# EAGLE design t_eau (EAGLE 8.4.3)
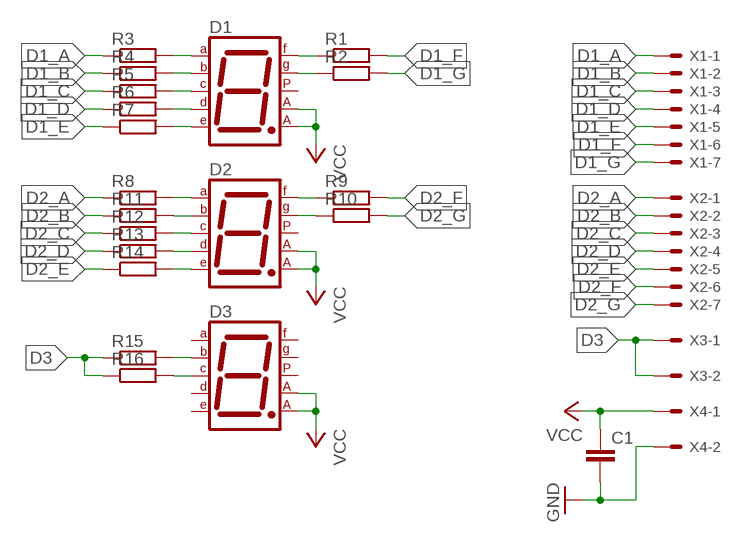
[diagram p0: schematic, sheet 1]

## Parts
C1  C-EU025-025X050  [C025-025X050]
D1  7SEG-CA  [7SEG-13]
D2  7SEG-CA  [7SEG-13]
D3  7SEG-CA  [7SEG-13]
R1  R-EU_0204/7  [0204/7]
R2  R-EU_0204/7  [0204/7]
R3  R-EU_0204/7  [0204/7]
R4  R-EU_0204/7  [0204/7]
R5  R-EU_0204/7  [0204/7]
R6  R-EU_0204/7  [0204/7]
R7  R-EU_0204/7  [0204/7]
R8  R-EU_0204/7  [0204/7]
R9  R-EU_0204/7  [0204/7]
R10  R-EU_0204/7  [0204/7]
R11  R-EU_0204/7  [0204/7]
R12  R-EU_0204/7  [0204/7]
R13  R-EU_0204/7  [0204/7]
R14  R-EU_0204/7  [0204/7]
R15  R-EU_0204/7  [0204/7]
R16  R-EU_0204/7  [0204/7]
X1  KK-156-7  [KK-156-7]
X2  KK-156-7  [KK-156-7]
X3  KK-156-2  [KK-156-2]
X4  KK-156-2  [KK-156-2]

## Nets
D1_A: R3.1 X1.1
D1_B: R4.1 X1.2
D1_C: R5.1 X1.3
D1_D: R6.1 X1.4
D1_E: R7.1 X1.5
D1_F: R1.2 X1.6
D1_G: R2.2 X1.7
D2_A: R8.1 X2.1
D2_B: R11.1 X2.2
D2_C: R12.1 X2.3
D2_D: R13.1 X2.4
D2_E: R14.1 X2.5
D2_F: R9.2 X2.6
D2_G: R10.2 X2.7
D3: R15.1 R16.1 X3.1 X3.2
GND: C1.2 X4.2
N$1: D1.7(A) R3.2
N$2: D1.6(B) R4.2
N$3: D1.4(C) R5.2
N$4: D1.2(D) R6.2
N$5: D1.1(E) R7.2
N$6: D1.9(F) R1.1
N$7: D1.10(G) R2.1
N$8: D2.7(A) R8.2
N$9: D2.6(B) R11.2
N$10: D2.4(C) R12.2
N$11: D2.2(D) R13.2
N$12: D2.1(E) R14.2
N$13: D2.9(F) R9.1
N$14: D2.10(G) R10.1
N$32: D3.4(C) R16.2
N$33: D3.6(B) R15.2
VCC: C1.1 D1.3(CA1) D1.8(CA2) D2.3(CA1) D2.8(CA2) D3.3(CA1) D3.8(CA2) X4.1
Unconnected: D1.5(DP) D2.5(DP) D3.1(E) D3.2(D) D3.5(DP) D3.7(A) D3.9(F) D3.10(G)

## Library data of the parts
C1 = rcl:C-EU: CAPACITOR, European symbol
D1-D3 = special:7SEG-CA: 7-segment DISPLAY single anode, 13 mm
R1-R16 = resistor:R-EU_: RESISTOR, European symbol
X1 X2 = con-molex:KK-156-7: KK 156 HEADER Source: http://www.molex.com/pdm_docs/sd/026604100_sd.pdf; OC_FARNELL: unknown; OC_NEWARK: unknown
X3 X4 = con-molex:KK-156-2: KK 156 HEADER Source: http://www.molex.com/pdm_docs/sd/026604100_sd.pdf; OC_FARNELL: unknown; OC_NEWARK: unknown

## Board
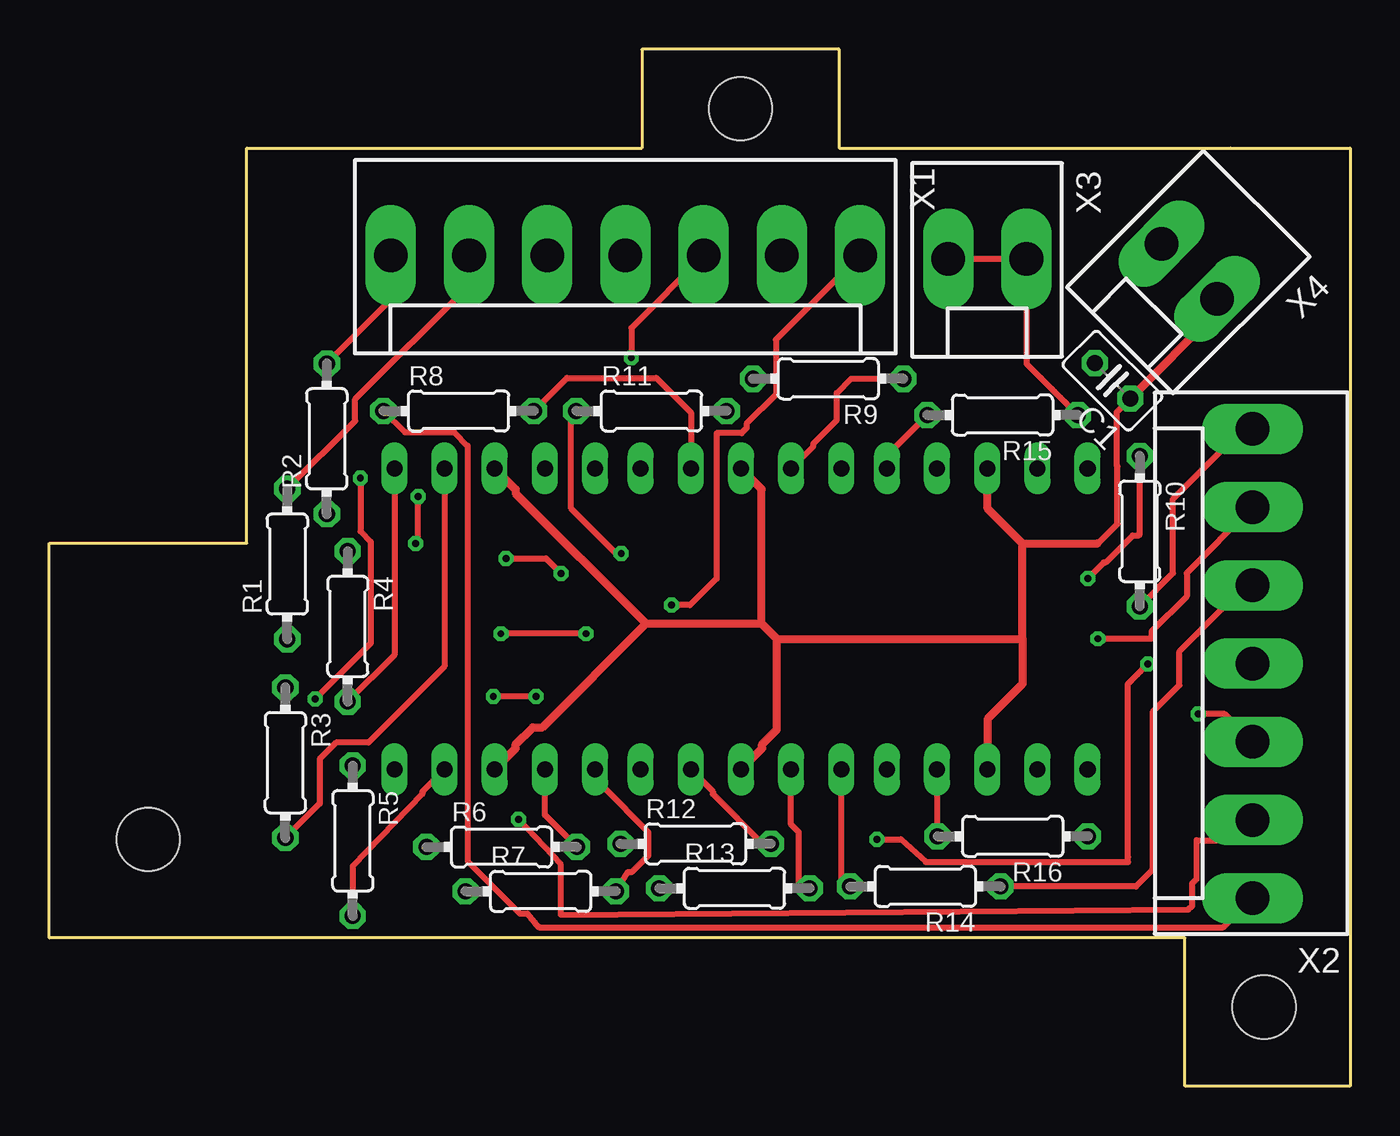
[diagram p1: board, top side]
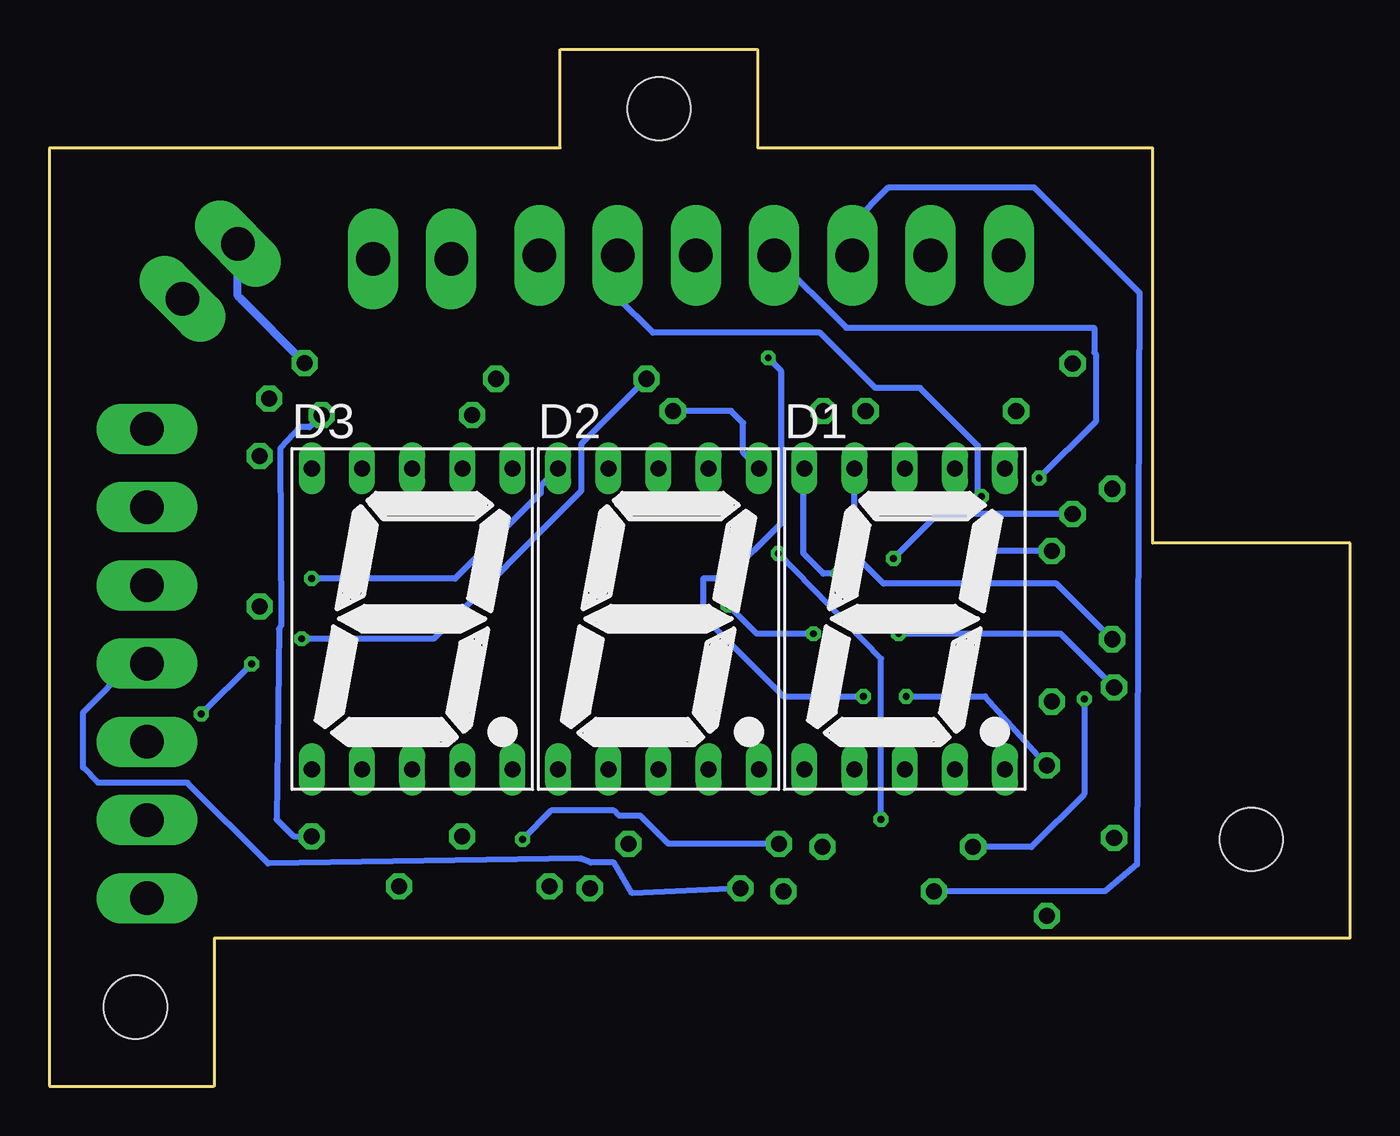
[diagram p2: board, bottom side, seen from below]

Size 65.86 x 52.5 mm. Coordinates in mm from the lower left corner, seen from the top.
Outline: 59.8,47.5 40,47.5 40,52.5 30,52.5 30,47.5 10,47.5 10,27.5 0,27.5 0,7.5 57.5,7.5 57.5,0
Outline: 59.82,47.5 65.86,47.5 65.86,0 57.53,0
Copper layers (1*16): Top 0.035mm / dielectric 1.5mm / Bottom 0.035mm
Design rules "default *": minimum track width 6mil, minimum drill 0.35mm, track to track 14mil, track to pad 14mil, pad to pad 14mil, via to via 14mil, smd to smd 6mil, copper to edge 40mil, drill to drill 6mil, minimum pad ring 10mil, minimum via ring 8mil, stop-mask expansion 4mil, vias tented up to drill 0mil, thermal gap 10mil
Holes 3.2 mm at 61.5,4 5,12.5 35,49.5

### Footprints (pad centres in the part's own frame; a part is rotated, then mirrored left to right if it is on the bottom)
C025-025X050 = drill 0.813 octagon: 1 -1.27,0; 2 1.27,0
7SEG-13 = drill 0.813 long: 1 -5.08,-7.62; 2 -2.54,-7.62; 3 0,-7.62; 4 2.54,-7.62; 5 5.08,-7.62; 6 5.08,7.62; 7 2.54,7.62; 8 0,7.62; 9 -2.54,7.62; 10 -5.08,7.62
0204/7 = drill 0.813 octagon: 1 -3.81,0; 2 3.81,0
KK-156-7 = drill 1.7 pad 2.184 long: 1 -11.88,0; 2 -7.92,0; 3 -3.96,0; 4 0,0; 5 3.96,0; 6 7.92,0; 7 11.88,0
KK-156-2 = drill 1.7 pad 2.184 long: 1 -1.98,0; 2 1.98,0

### Placement (x,y rotation side)
C1  53.83,35.72 135 top
D1  22.55,23.66 0 bottom
D2  35.02,23.66 0 bottom
D3  47.49,23.66 0 bottom
R1  12.05,26.44 90 top
R2  14.05,32.78 90 top
R3  11.95,16.38 270 top
R4  15.11,23.28 270 top
R5  15.36,12.42 270 top
R6  22.9,12.11 0 top
R7  24.88,9.86 0 top
R8  20.72,34.19 0 top
R9  39.43,35.82 180 top
R10  55.21,28.1 270 top
R11  30.49,34.19 0 top
R12  32.72,12.27 0 top
R13  34.69,10.02 0 top
R14  44.35,10.11 180 top
R15  48.26,33.98 180 top
R16  48.78,12.65 180 top
X1  29.17,42.06 180 top
X2  60.92,21.4 90 top
X3  47.49,41.9 180 top
X4  57.72,41.26 135 top

### Tracks (layer width: path | path; a pad name or v marks a point on that pad's centre or on a via)
D1_A  (via drill 0.35)
  Top 0.305: X1.1 36.79,37.8 36.79,35.03 35.31,33.55 35.31,33.32 35.05,33.07 33.78,33.07 33.78,25.7 32.43,24.36 v31.5,24.36 | v27.18,22.91 v22.86,22.91
  Bottom 0.305: v31.5,24.36 30.05,22.91 v27.18,22.91 | v22.86,22.91 14.67,22.91 R3.1
D1_B  (via drill 0.35)
  Top 0.305: v18.54,27.48 18.68,27.62 v18.68,29.86
  Bottom 0.305: R4.1 18.15,27.09 v18.54,27.48 | v18.68,29.86 18.84,30.02 18.84,32.42 21.78,35.36 24.05,35.36 26.84,38.15 35.31,38.15 37.09,39.93 X1.2
D1_C  (via drill 0.35)
  Top 0.305: X1.3 29.46,38.39 v29.46,36.88 | v24.64,19.74 v22.48,19.74
  Bottom 0.305: v29.46,36.88 28.83,36.25 28.83,28.5 31.62,25.7 32.77,25.7 32.77,23.8 28.7,19.74 v24.64,19.74 | v22.48,19.74 18.48,19.74 R5.1
D1_D  (via drill 0.35)
  Top 0.305: v15.75,30.78 15.75,28.1 16.28,27.57 16.28,22.42 v13.46,19.61
  Bottom 0.305: X1.4 25.51,38.4 12.95,38.4 12.95,37.15 12.88,37.07 12.88,33.65 v15.75,30.78 | v13.46,19.61 13.46,14.78 16.13,12.11 R6.1
D1_E
  Bottom 0.305: X1.5 25.21,43.67 23.37,45.52 16,45.52 10.67,40.18 10.79,11.23 12.41,9.86 R7.1
D1_F
  Top 0.305: R1.2 15.49,33.69 15.49,34.78 21.25,40.54 X1.6
D1_G
  Top 0.305: R2.2 17.29,39.83 X1.7
D2_A
  Top 0.305: R8.1 17.99,33.11 20.49,33.11 21.18,32.42 21.18,11.38 23.82,8.75 24.2,8.75 24.77,8.05 59.45,8.05 X2.1
D2_B  (via drill 0.35)
  Top 0.305: v23.75,13.51 25.91,11.23 25.91,8.69 57.68,8.94 57.86,9.13 57.86,10.26 58.09,10.49 58.09,12.45 59.89,12.45 X2.2 | v28.96,26.97 28.7,26.97 26.42,29.26 26.42,33.93 R11.1
  Bottom 0.305: v23.75,13.51 23.75,21.64 v28.96,26.97
D2_C  (via drill 0.35)
  Top 0.305: v41.91,12.5 43.11,12.5 44.38,11.36 54.61,11.36 54.61,11.61 54.61,20.37 v55.63,21.39 | X2.3 59.51,18.85 v58.17,18.85
  Bottom 0.305: R12.1 34.52,12.27 35.94,13.69 37.01,13.69 37.27,13.96 40.45,13.96 v41.91,12.5 | v55.63,21.39 v58.17,18.85
D2_D
  Bottom 0.305: R13.1 36.36,9.77 37.27,11.32 38.45,11.32 39,11.53 54.79,11.28 58.88,15.37 63.4,15.37 64.16,16.13 64.16,18.92 61.68,21.4 X2.4
D2_E
  Top 0.305: R14.1 55.02,10.11 55.88,10.97 55.88,18.97 57.23,20.31 57.23,22.02 60.56,25.36 X2.5
D2_F  (via drill 0.35)
  Top 0.305: v53.09,22.66 55.81,22.66 55.81,23.01 57.58,24.79 57.58,25.98 X2.6
  Bottom 0.305: R9.2 38.93,32.51 38.93,30.14 46.41,22.66 v53.09,22.66
D2_G
  Top 0.305: R10.2 56.9,25.98 56.9,29.74 60.43,33.28 X2.7
D3
  Top 0.305: R15.1 49.47,36.58 X3.1 X3.2
  Bottom 0.305: R15.1 52.69,33.36 53.16,33.36 54.17,32.28 54.12,23.35 54.23,23.13 54.36,13.51 53.49,12.65 R16.1
GND
  Bottom 0.406: C1.2 56.13,39.82 56.32,40.01 X4.2
N$1
  Top 0.305: R3.2 13.69,14.31 13.69,16.57 14.52,17.4 16.16,17.4 20.01,21.25 D1.7
N$2
  Top 0.305: D1.6 17.47,21.83 R4.2
N$3
  Top 0.305: D1.4 18.89,14.92 18.89,14.79 15.36,11.14 R5.2
N$4
  Top 0.305: R6.2 25.09,13.73 D1.2
N$5
  Top 0.305: D1.1 28.05,15.62 28.05,15.14 30.33,12.86 30.33,11.68 29.5,10.85 29.29,10.85 R7.2
N$6
  Bottom 0.305: R1.1 14.87,25.45 23.62,25.45 25.09,26.92 D1.9
N$7  (via drill 0.35)
  Top 0.305: v23.11,26.72 25.15,26.72 v25.91,25.96
  Bottom 0.305: R2.1 20.86,28.97 v23.11,26.72 | v25.91,25.96 26.67,25.96 27.69,26.97 27.69,31.22 D1.10
N$8
  Top 0.305: R8.2 26.2,35.86 30.73,35.86 32.48,34.12 D2.7
N$9
  Bottom 0.305: D2.6 30.73,32.07 30.73,33.58 31.35,34.19 R11.2
N$10
  Top 0.305: D2.4 33.6,14.92 33.6,14.79 36.12,12.27 R12.2
N$11
  Top 0.305: D2.2 37.56,13.25 37.95,12.86 37.95,10.19 R13.2
N$12
  Top 0.305: R14.2 40.1,10.17 D2.1
N$13
  Top 0.305: D2.9 38.68,32.4 38.68,32.53 39.88,33.73 39.88,35.1 40.59,35.82 R9.1
N$14  (via drill 0.35)
  Top 0.305: v52.58,25.7 53.39,26.52 53.49,26.52 54.86,27.89 55.17,27.89 55.21,27.93 R10.1
  Bottom 0.305: D2.10 40.99,30.39 40.99,30.03 45.31,25.7 v52.58,25.7
N$32
  Top 0.305: R16.2 44.97,16.02 D3.4
N$33
  Top 0.305: R15.2 42.41,31.94 D3.6
VCC
  Top 0.305: 53.09,27.48 54.08,28.47 54.08,31.39 54.04,31.43 54.04,34.13 C1.1
  Top 0.406: C1.1 59.12,39.21 X4.1 | 49.28,27.48 53.09,27.48 | 49.28,27.48 47.5,29.26 D3.8 | 49.28,22.66 49.28,27.48 | 49.28,22.66 49.28,20.37 47.5,18.59 D3.3 | D2.8 36.07,30.23 36.07,23.42 | 36.83,22.66 36.07,23.42 | 36.83,22.66 49.28,22.66 | D2.3 36.09,17.11 36.09,17.31 36.83,18.05 36.83,22.66 | D1.8 23.62,30.21 23.62,30.01 30.21,23.42 | 30.21,23.42 36.07,23.42 | 30.21,23.42 24.96,18.17 24.48,18.17 23.62,17.31 23.62,17.11 D1.3